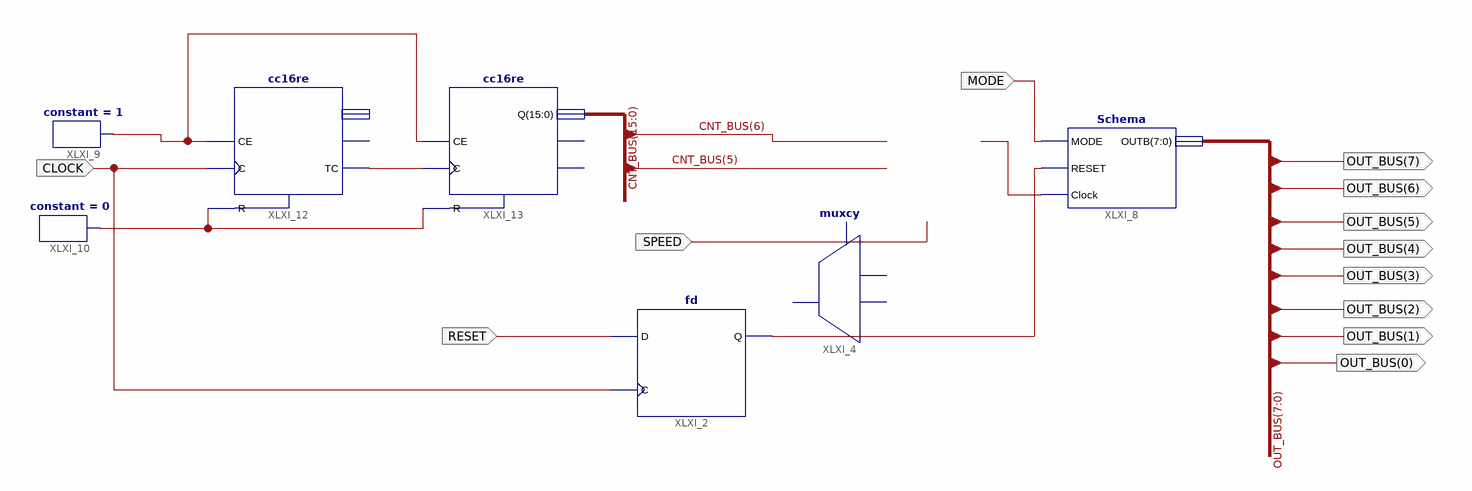
[diagram p0: schematic sheet 1]
// Xilinx ISE schematic TopLevel.sch (spartan3a) as structural Verilog: 7 symbols, 12 ports
module TopLevel (
  input  SPEED,
  input  RESET,
  input  MODE,
  input  CLOCK,
  output [7:0] OUT_BUS
);

  wire XLXN_16, XLXN_18, XLXN_32, XLXN_36, XLXN_39;
  wire [15:0] CNT_BUS;

  muxcy XLXI_4 (.CI(CNT_BUS[6]), .DI(CNT_BUS[5]), .S(SPEED), .O(XLXN_16));
  fd XLXI_2 (.C(CLOCK), .D(RESET), .Q(XLXN_18));
  Schema XLXI_8 (.MODE(MODE), .RESET(XLXN_18), .Clock(XLXN_16), .OUTB(OUT_BUS));
  constant #(.CValue("1")) XLXI_9 (.O(XLXN_36));
  constant #(.CValue("0")) XLXI_10 (.O(XLXN_39));
  cc16re XLXI_12 (.C(CLOCK), .CE(XLXN_36), .R(XLXN_39), .TC(XLXN_32));  // open: CEO, Q
  cc16re XLXI_13 (.C(XLXN_32), .CE(XLXN_36), .R(XLXN_39), .Q(CNT_BUS));  // open: CEO, TC
endmodule
